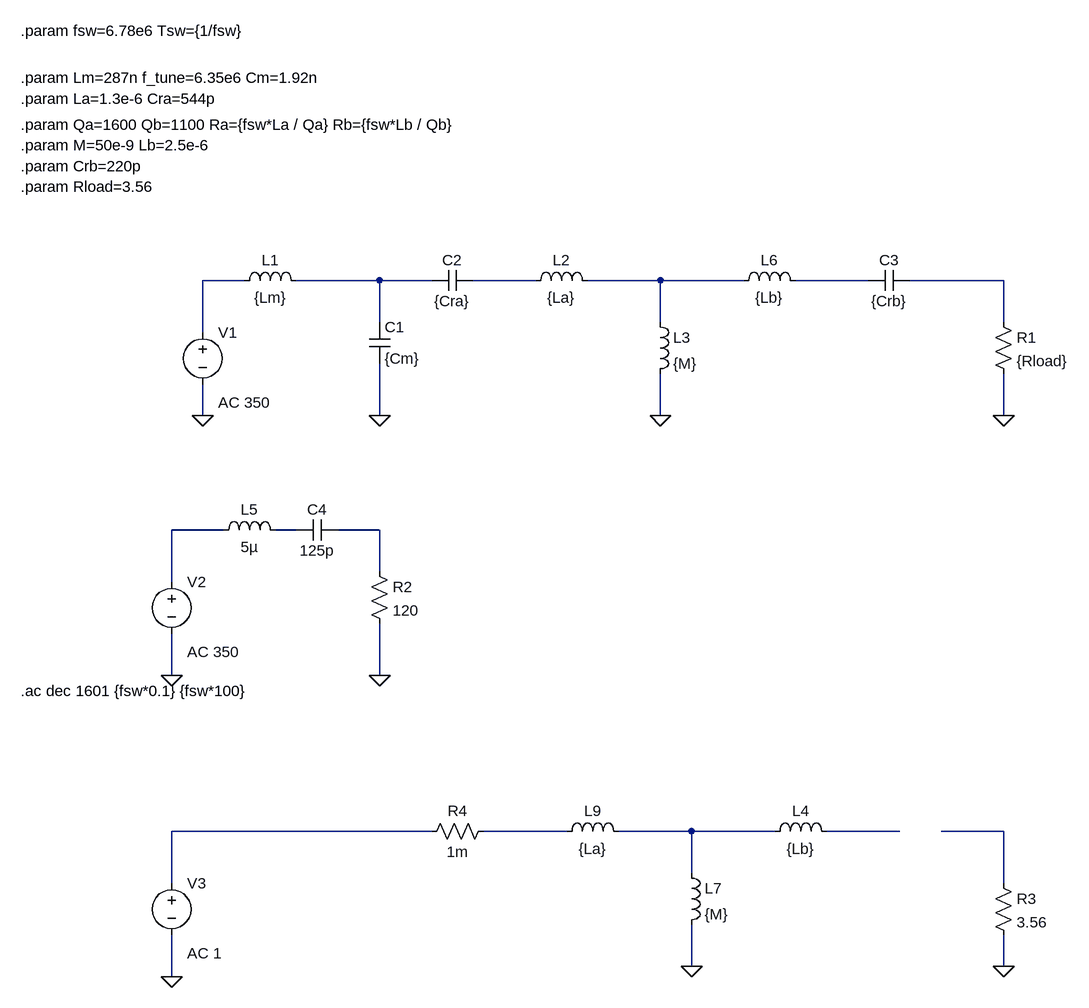
[diagram p0: schematic AC_analysis.asc]
AC_analysis.asc, the LTspice schematic file:
Version 4.1
SHEET 1 1300 1140
WIRE -112 48 -176 48
WIRE 96 48 -32 48
WIRE 176 48 96 48
WIRE 336 48 240 48
WIRE 528 48 416 48
WIRE 656 48 528 48
WIRE 848 48 736 48
WIRE 1056 48 912 48
WIRE 96 112 96 48
WIRE 528 112 528 48
WIRE 1056 112 1056 48
WIRE -176 128 -176 48
WIRE -176 256 -176 208
WIRE 96 256 96 176
WIRE 528 256 528 192
WIRE 1056 256 1056 192
WIRE -144 432 -224 432
WIRE -32 432 -64 432
WIRE 96 432 32 432
WIRE 96 496 96 432
WIRE -224 512 -224 432
WIRE -224 656 -224 592
WIRE 96 656 96 576
WIRE 176 896 -224 896
WIRE 384 896 256 896
WIRE 576 896 464 896
WIRE 704 896 576 896
WIRE 896 896 784 896
WIRE 1056 896 960 896
WIRE 576 960 576 896
WIRE -224 976 -224 896
WIRE 1056 976 1056 896
WIRE 576 1104 576 1040
WIRE 1056 1104 1056 1056
WIRE -224 1120 -224 1056
FLAG 96 256 0
FLAG 528 256 0
FLAG -176 256 0
FLAG 1056 256 0
FLAG -224 656 0
FLAG 96 656 0
FLAG -224 1120 0
FLAG 576 1104 0
FLAG 1056 1104 0
SYMBOL voltage -176 112 R0
WINDOW 123 24 124 Left 2
WINDOW 39 0 0 Left 0
SYMATTR Value2 AC 350
SYMATTR InstName V1
SYMATTR Value ""
SYMBOL ind -128 64 R270
WINDOW 0 32 56 VTop 2
WINDOW 3 5 56 VBottom 2
SYMATTR InstName L1
SYMATTR Value {Lm}
SYMATTR SpiceLine Rser=1m
SYMBOL cap 80 112 R0
SYMATTR InstName C1
SYMATTR Value {Cm}
SYMBOL cap 176 64 R270
WINDOW 0 32 32 VTop 2
WINDOW 3 0 32 VBottom 2
SYMATTR InstName C2
SYMATTR Value {Cra}
SYMBOL ind 320 64 R270
WINDOW 0 32 56 VTop 2
WINDOW 3 5 56 VBottom 2
SYMATTR InstName L2
SYMATTR Value {La}
SYMATTR SpiceLine Rser={Ra}
SYMBOL ind 512 96 R0
SYMATTR InstName L3
SYMATTR Value {M}
SYMATTR SpiceLine Rser=1m
SYMBOL ind 688 912 R270
WINDOW 0 32 56 VTop 2
WINDOW 3 5 56 VBottom 2
SYMATTR InstName L4
SYMATTR Value {Lb}
SYMATTR SpiceLine Rser={Rb}
SYMBOL cap 848 64 R270
WINDOW 0 32 32 VTop 2
WINDOW 3 0 32 VBottom 2
SYMATTR InstName C3
SYMATTR Value {Crb}
SYMBOL res 1040 96 R0
SYMATTR InstName R1
SYMATTR Value {Rload}
SYMBOL voltage -224 496 R0
WINDOW 123 24 124 Left 2
WINDOW 39 0 0 Left 0
SYMATTR Value2 AC 350
SYMATTR InstName V2
SYMATTR Value ""
SYMBOL ind -160 448 R270
WINDOW 0 32 56 VTop 2
WINDOW 3 5 56 VBottom 2
SYMATTR InstName L5
SYMATTR Value 5µ
SYMATTR SpiceLine Rser=1m
SYMBOL cap 32 416 R90
WINDOW 0 0 32 VBottom 2
WINDOW 3 32 32 VTop 2
SYMATTR InstName C4
SYMATTR Value 125p
SYMBOL res 80 480 R0
SYMATTR InstName R2
SYMATTR Value 120
SYMBOL voltage -224 960 R0
WINDOW 123 24 124 Left 2
WINDOW 39 0 0 Left 0
SYMATTR Value2 AC 1
SYMATTR InstName V3
SYMATTR Value ""
SYMBOL res 1040 960 R0
SYMATTR InstName R3
SYMATTR Value 3.56
SYMBOL res 272 880 R90
WINDOW 0 0 56 VBottom 2
WINDOW 3 32 56 VTop 2
SYMATTR InstName R4
SYMATTR Value 1m
SYMBOL ind 368 912 R270
WINDOW 0 32 56 VTop 2
WINDOW 3 5 56 VBottom 2
SYMATTR InstName L9
SYMATTR Value {La}
SYMATTR SpiceLine Rser={Ra}
SYMBOL ind 640 64 R270
WINDOW 0 32 56 VTop 2
WINDOW 3 5 56 VBottom 2
SYMATTR InstName L6
SYMATTR Value {Lb}
SYMATTR SpiceLine Rser={Rb}
SYMBOL ind 560 944 R0
SYMATTR InstName L7
SYMATTR Value {M}
SYMATTR SpiceLine Rser=1m
TEXT -456 -264 Left 2 !.param Lm=287n f_tune=6.35e6 Cm=1.92n
TEXT -456 -232 Left 2 !.param La=1.3e-6 Cra=544p
TEXT -456 -160 Left 2 !.param M=50e-9 Lb=2.5e-6
TEXT -456 -128 Left 2 !.param Crb=220p
TEXT -456 -336 Left 2 !.param fsw=6.78e6 Tsw={1/fsw}
TEXT -456 -96 Left 2 !.param Rload=3.56
TEXT -456 680 Left 2 !.ac dec 1601 {fsw*0.1} {fsw*100}
TEXT -456 -192 Left 2 !.param Qa=1600 Qb=1100 Ra={fsw*La / Qa} Rb={fsw*Lb / Qb}

The netlist it stands for:
* AC_analysis.asc
V1 N001 0 AC 350
L1 N001 N002 {Lm} Rser=1m
C1 N002 0 {Cm}
C2 N002 N003 {Cra}
L2 N003 N004 {La} Rser={Ra}
L3 N004 0 {M} Rser=1m
L4 N012 N013 {Lb} Rser={Rb}
C3 N005 N006 {Crb}
R1 N006 0 {Rload}
V2 N007 0 AC 350
L5 N007 N008 5µ Rser=1m
C4 N009 N008 125p
R2 N009 0 120
V3 N010 0 AC 1
R3 N014 0 3.56
R4 N011 N010 1m
L9 N011 N012 {La} Rser={Ra}
L6 N004 N005 {Lb} Rser={Rb}
L7 N012 0 {M} Rser=1m
.param Lm=287n f_tune=6.35e6 Cm=1.92n
.param La=1.3e-6 Cra=544p
.param M=50e-9 Lb=2.5e-6
.param Crb=220p
.param fsw=6.78e6 Tsw={1/fsw}
.param Rload=3.56
.ac dec 1601 {fsw*0.1} {fsw*100}
.param Qa=1600 Qb=1100 Ra={fsw*La / Qa} Rb={fsw*Lb / Qb}
.backanno
.end